# Altium schematic sheet MCU_64.SchDoc: MCU
size A4; DocumentNumber: MB1136; Revision: C.3; SheetNumber: 2; SheetTotal: 4; Project: NUCLEO-XXXXRX
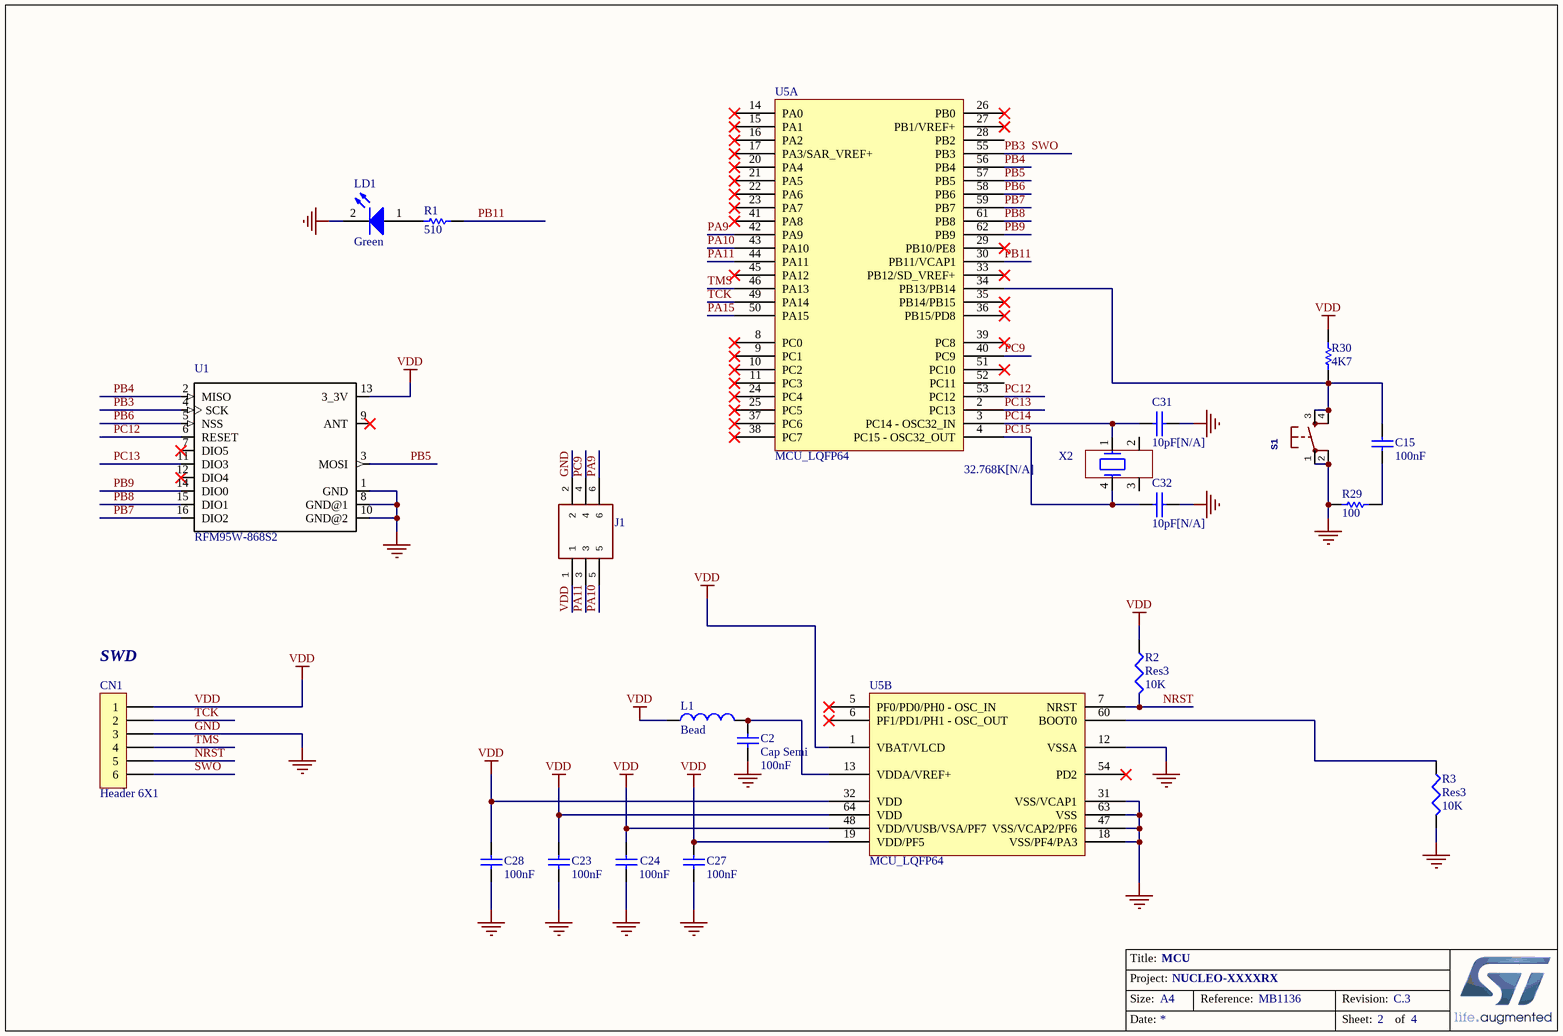
[diagram p0: MCU_64.SchDoc]

## Parts
C2  Cap Semi  value 100nF  [1608[0603]]
C15  100nF  [RAD-0.3]
C23  100nF  [0603C]
C24  100nF  [0603C]
C27  100nF  [0603C]
C28  100nF  [0603C]
C31  10pF[N/A]  [0603C]
C32  10pF[N/A]  [0603C]
CN1  Header 6X1  [1*6P]
J1  PIN-HEAD-1.27MM-2X03  [PIN-HEAD-1.27MM-2X03]  (value not drawn)
L1  Bead  [INDC1608L]
LD1  Green  [0603D]
R1  510  [0603R]
R2  Res3  value 10K  [J1-0603]
R3  Res3  value 10K  [J1-0603]
R29  100  [0603R]
R30  4K7  [0603R]
S1  (no value)  [TACTILE_SWITCH_SMD]
U1  RFM95W-868S2  [XCVR_RFM95W-868S2]
U5  MCU_LQFP64  [LQFP64]  (parts A,B of 2)
X2  32.768K[N/A]  [XTAL_4SM_8X3R8]

## Nets
GND: C2.2 C23.2 C24.2 C27.2 C28.2 C31.2 C32.2 CN1.3 J1.2 LD1.2(K) R3.2 R29.1 S1.1 S1.2 U1.1(GND) U1.8(GND@1) U1.10(GND@2) U5.12(VSSA) U5.18(VSS/PF4/PA3) U5.31(VSS/VCAP1) U5.47(VSS/VCAP2/PF6) U5.63(VSS)
VDD: C23.1 C24.1 C27.1 C28.1 CN1.1 J1.1 L1.1 R2.1 R30.2 U1.13(3_3V) U5.1(VBAT/VLCD) U5.19(VDD/PF5) U5.32(VDD) U5.48(VDD/VUSB/VSA/PF7) U5.64(VDD)
NRST: CN1.5 R2.2 U5.7(NRST)
PA9: J1.6 U5.42(PA9)
PA10: J1.5 U5.43(PA10)
PA11: J1.3 U5.44(PA11)
PA15: U5.50(PA15)
PB3: CN1.6 U1.4(SCK) U5.55(PB3)  [also labelled SWO]
PB4: U1.2(MISO) U5.56(PB4)
PB5: U1.3(MOSI) U5.57(PB5)
PB6: U1.5(NSS) U5.58(PB6)
PB7: U1.16(DIO2) U5.59(PB7)
PB8: U1.15(DIO1) U5.61(PB8)
PB9: U1.14(DIO0) U5.62(PB9)
PB11: R1.1 U5.30(PB11/VCAP1)
PC9: J1.4 U5.40(PC9)
PC12: U1.6(RESET) U5.53(PC12)
PC13: U1.11(DIO3) U5.2(PC13)
PC14: C31.1 U5.3(PC14_-_OSC32_IN) X2.1
PC15: C32.1 U5.4(PC15_-_OSC32_OUT) X2.4
TCK: CN1.2 U5.49(PA14)
TMS: CN1.4 U5.46(PA13)
NetC2_1: C2.1 L1.2 U5.13(VDDA/VREF+)
NetC15_1: C15.1 R29.2
NetC15_2: C15.2 R30.1 S1.3 S1.4 U5.34(PB13/PB14)
NetLD1_1: LD1.1(A) R1.2
NetR3_1: R3.1 U5.60(BOOT0)

Not connected (* = marked no-connect by the designer): U1 7(DIO5)* 9(ANT)* 12(DIO4)*; U5 5(PF0/PD0/PH0_-_OSC_IN)* 6(PF1/PD1/PH1_-_OSC_OUT)* 8(PC0)* 9(PC1)* 10(PC2)* 11(PC3)* 14(PA0)* 15(PA1)* 16(PA2)* 17(PA3/SAR_VREF+)* 20(PA4)* 21(PA5)* 22(PA6)* 23(PA7)* 24(PC4)* 25(PC5)* 26(PB0)* 27(PB1/VREF+)* 28(PB2) 29(PB10/PE8)* 33(PB12/SD_VREF+)* 35(PB14/PB15)* 36(PB15/PD8)* 37(PC6)* 38(PC7)* 39(PC8)* 41(PA8)* 45(PA12)* 51(PC10)* 52(PC11) 54(PD2)*; X2 2 3

## Notes on the sheet
- (near CN1) SWD
- Title:
- Project:
- Size:
- Date:
- A4
- Reference:
- Sheet:
- Revision:
- of

## Library data of the parts
C2 = Cap Semi: Capacitor (Semiconductor SIM Model); Published: 8-Jun-2000; LatestRevisionDate: 29-May-2009; LatestRevisionNote: IPC-7351 Footprint Added.; PackageReference: C1206; Publisher: Altium Limited; PackageDescription: Chip Capacitor
C15 = CAP: Capacitor; Value: 100pF; Published: 8-Jun-2000; Revision: July-2002: Re-released for DXP Platform.; Publisher: Altium Limited
C23 C24 C27 C28 = Cap: Capacitor; Value: 10nF; Published: 8-Jun-2000; Revision: July-2002: Re-released for DXP Platform.; Publisher: Altium Limited
C31 C32 = CAP: Capacitor
CN1 = Header 6X1: Header, 6-Pin, Single row; LatestRevisionDate: 17-Jul-2002; LatestRevisionNote: Re-released for DXP Platform.; Publisher: Altium Limited
L1 = Inductor: Code_IEC: 1005; Value: 10mH; Published: 8-Jun-2000; LatestRevisionDate: 29-May-2009; LatestRevisionNote: IPC-7351 Footprint Added.; PackageReference: 0402-A; Publisher: Altium Limited; PackageDescription: Chip Inductor; Code_JEITA: 0402
LD1 = LED2: Typical RED, GREEN, YELLOW, AMBER GaAs LED; Published: 8-Jun-2000; Revision: July-2002: Re-released for DXP Platform.; Publisher: Altium Limited
R1 R29 = Res1: Resistor; Value: 1K; Published: 8-Jun-2000; Revision: July-2002: Re-released for DXP Platform.; Publisher: Altium Limited
R2 R3 = Res3: Resistor; Published: 8-Jun-2000; LatestRevisionDate: 29-May-2009; LatestRevisionNote: IPC-7351 Footprint Added.; PackageReference: J1-0603; Publisher: Altium Limited; PackageDescription: Chip Resistor
R30 = res1: Resistor; Value: 1K; Published: 8-Jun-2000; Revision: July-2002: Re-released for DXP Platform.; Publisher: Altium Limited
S1 = TAC_SWITCHSND
U1 = RFM95W-868S2: MF: Hope Microelectronics; Availability: Bad; Package: SMD-16 Hope Microelectronics; Price: 8.44 USD; MP: RFM95W-868S2; Value: *
X2 = MC306